# EAGLE design LT3652 (EAGLE 7.1.0)
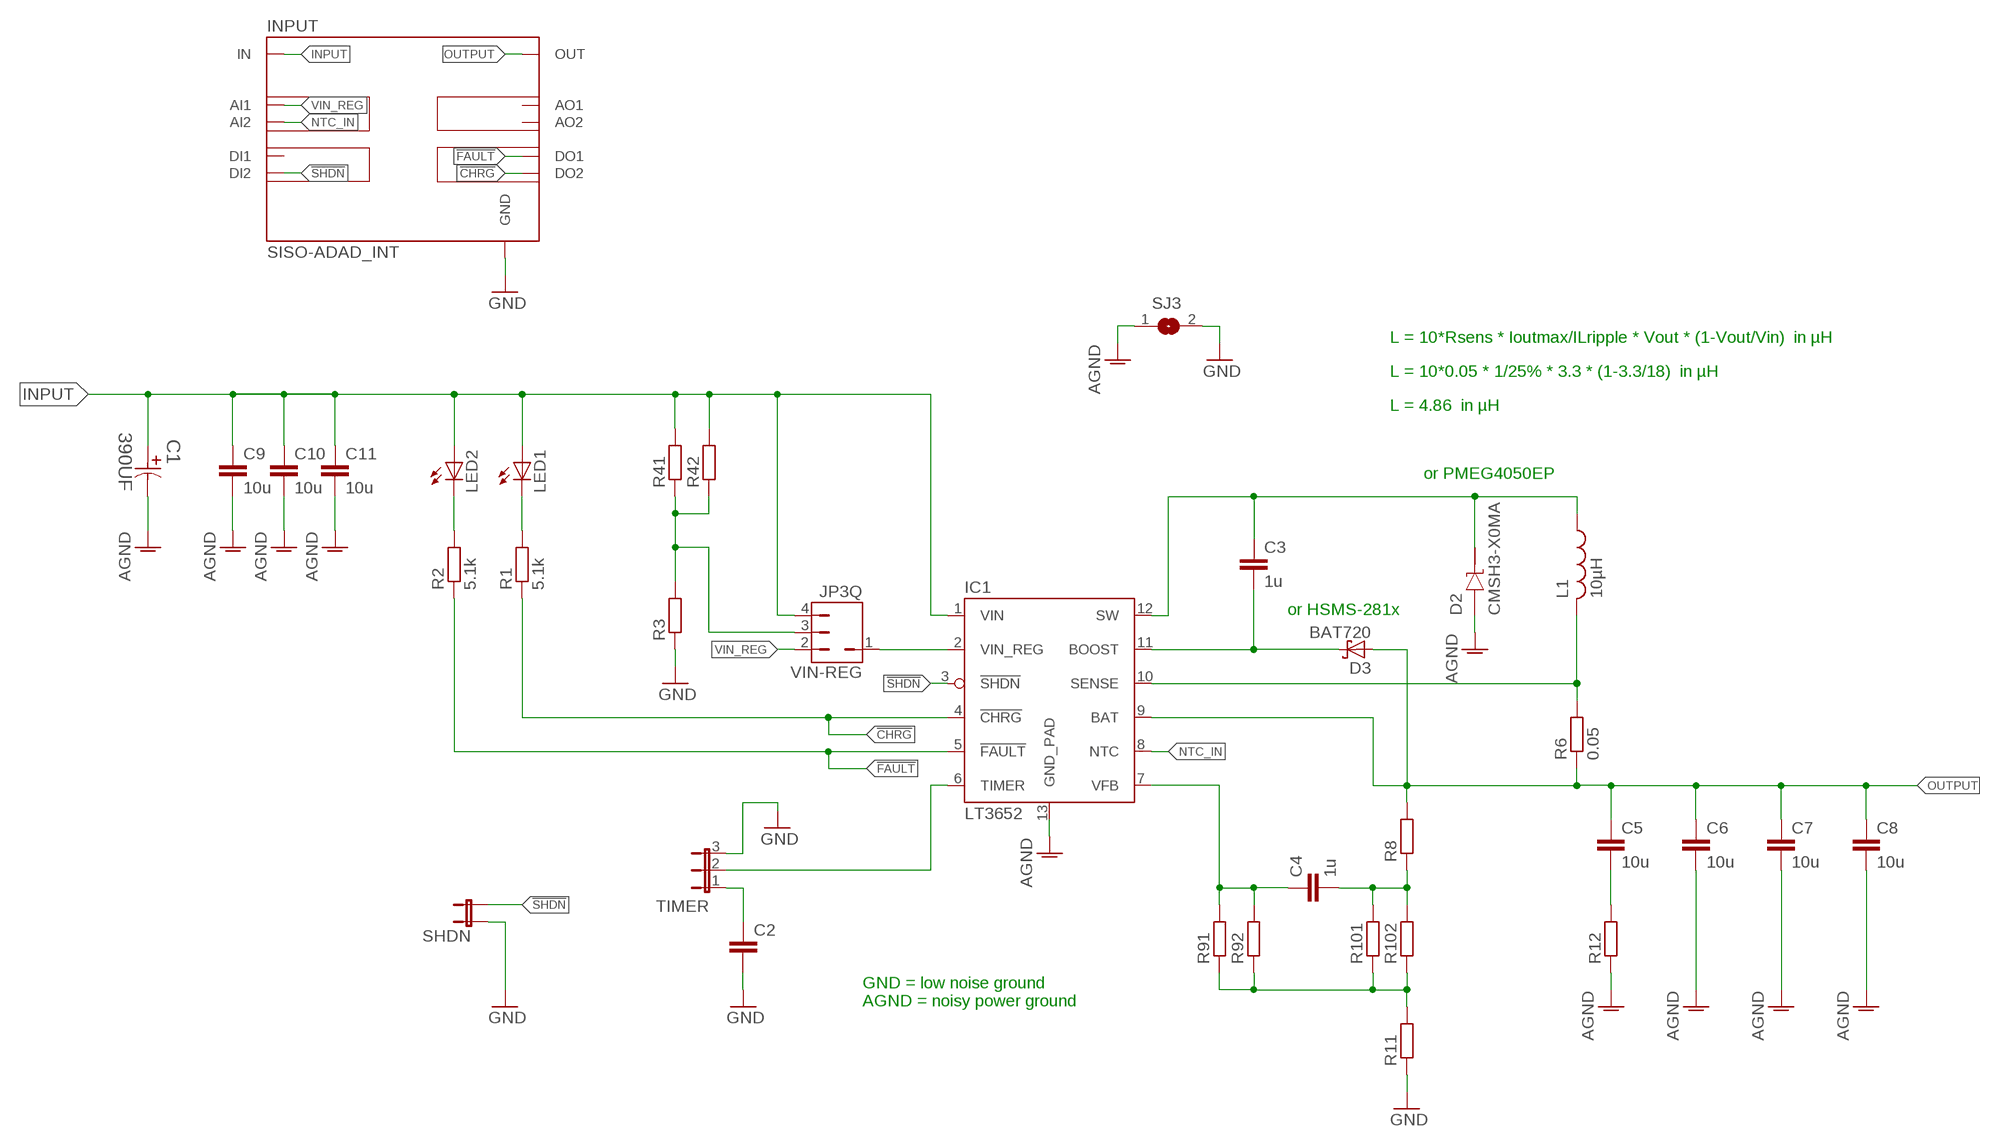
[diagram p0: schematic, sheet 1]

## Parts
C1  390UF  EEE-FPV391UAP-CASE-G  [CAPAE1030X1050N]
C2  C-EUC0805  [C0805]
C3  1u  C-EUC0805  [C0805]
C4  1u  C-EUC0805  [C0805]
C5  10u  C-EUC0805  [C0805]
C6  10u  C-EUC0805  [C0805]
C7  10u  C-EUC0805  [C0805]
C8  10u  C-EUC0805  [C0805]
C9  10u  C-EUC0805  [C0805]
C10  10u  C-EUC0805  [C0805]
C11  10u  C-EUC0805  [C0805]
D2  CMSH3-X0MA  [DIODE_SMA]
D3  BAT720  BAS70  [SOT23]
IC1  LT3652  [MSOP-12_GND]
INPUT  SISO-ADAD_INT  [SISO-ADAD]
L1  10µH  IHLP-2525CZ-01  [2525]
LED1  LEDCHIP-LED0805  [CHIP-LED0805]
LED2  LEDCHIP-LED0805  [CHIP-LED0805]
R1  5.1k  R-EU_R0805  [R0805]
R2  5.1k  R-EU_R0805  [R0805]
R3  R-EU_R0805  [R0805]
R6  0.05  R-EU_R1206  [R1206]
R8  R-EU_R0805  [R0805]
R11  R-EU_R0805  [R0805]
R12  R-EU_R0805  [R0805]
R41  R-EU_R0805  [R0805]
R42  R-EU_R0805  [R0805]
R91  R-EU_R0805  [R0805]
R92  R-EU_R0805  [R0805]
R101  R-EU_R0805  [R0805]
R102  R-EU_R0805  [R0805]
SHDN  JP2_SMALL_PAD  [JP2_SMALL_PAD]
SJ3  SJ2  [SJ2]
TIMER  JP3_SMALL_PAD  [JP3_SMALL_PAD]
VIN-REG  JP3Q  [JP1-3]

## Nets
!CHRG: IC1.4(!CHRG) INPUT.DO2 R1.1
!FAULT: IC1.5(!FAULT) INPUT.DO1 R2.1
!SHDN: IC1.3(!SHDN) INPUT.DI2 SHDN.2
AGND: C1.2 C6.2 C7.2 C8.2 C9.2 C10.2 C11.2 D2.A IC1.13(GND_PAD) R12.1 SJ3.1
D1: LED2.C R2.2
GND: C2.2 INPUT.GND1(GND) INPUT.GND2(GND) INPUT.GND3(GND) INPUT.GND4(GND) R3.1 R11.1 SHDN.1 SJ3.2 TIMER.3
INPUT: C1.1 C9.1 C10.1 C11.1 IC1.1(VIN) INPUT.IN1(IN) INPUT.IN2(IN) INPUT.IN3(IN) INPUT.IN4(IN) LED1.A LED2.A R41.2 R42.2 VIN-REG.4
N$1: IC1.6(TIMER) TIMER.2
N$4: LED1.C R1.2
N$6: R3.2 R41.1 R42.1 VIN-REG.3
N$7: IC1.2(VIN_REG) VIN-REG.1
N$9: C3.1 D2.C IC1.12(SW) L1.P$2
N$10: C3.2 D3.3(C) IC1.11(BOOST)
N$12: C2.1 TIMER.1
N$14: R11.2 R91.1 R92.1 R101.1 R102.1
N$15: C4.2 R8.1 R101.2 R102.2
N$16: C5.2 R12.2
N$17: IC1.10(SENSE) L1.P$1 R6.2
N$18: C4.1 IC1.7(VFB) R91.2 R92.2
NTC_IN: IC1.8(NTC) INPUT.AI2
OUTPUT: C5.1 C6.1 C7.1 C8.1 D3.1(A) IC1.9(BAT) INPUT.OUT1_1(OUT) INPUT.OUT1_2(OUT) INPUT.OUT1_3(OUT) INPUT.OUT1_4(OUT) R6.1 R8.2
VIN_REG: INPUT.AI1 VIN-REG.2
Unconnected: INPUT.AO1 INPUT.AO2 INPUT.DI1

## Notes on the sheet
- L = 10*Rsens * Ioutmax/ILripple * Vout * (1-Vout/Vin)  in µH
- L = 10*0.05 * 1/25% * 3.3 * (1-3.3/18)  in µH
- L = 4.86  in µH
- or PMEG4050EP
- or HSMS-281x
- GND = low noise ground
  AGND = noisy power ground

## Library data of the parts
C1 = Panasonic-EEEFK_EEEFP:EEE-: Aluminum Electrolytic Capacitors,Surface Mount Type; MPN: EEE-FPV391UAP; OC_FARNELL: 1539521; OC_NEWARK: 94M7004; PACKAGE: CASE-G; SUPPLIER: PANASONIC; TOLERANCE: ±20 %; VOLTAGERATING: 35V
C2-C11 = rcl:C-EU: CAPACITOR, European symbol
D2 = CMSH3-SMD-Diode:CMSH3-X0MA
D3 = diode:BAS70: Silicon Schottky Diodes General-purpose diode for high-speed switching
IC1 = LT3652:LT3652: LT3652 MPPT Solar Charge Controller 5V-32V smart charger for batteries up to 14.4V
INPUT = AllModules:SISO-ADAD_INT
L1 = Inductor-IHLP2525CZER100M11:IHLP-2525CZ-01
LED1 LED2 = led:LED: LED OSRAM: - CHIPLED LG R971, LG N971, LY N971, LG Q971, LY Q971, LO R971, LY R971 LH N974, LH R974 LS Q976, LO Q976, LY Q976 LO Q996 - Hyper CHIPLED LW Q18S LB Q993, LB Q99A, LB R99A - SideLED LS A670, LO A670, LY A670, LG A670, LP A670 LB A673, LV A673, LT A673, LW A673 LH A674 LY A675 LS A676, LA A676, LO A676, LY A676, LW A676 LS A679, LY A679, LG A679 - Hyper Micro SIDELED® LS Y876, LA Y876, LO Y876, LY Y876 LT Y87S - SmartLED LW L88C, LW L88S LB L89C, LB L89S, LG L890 LS L89K, LO L89K, LY L89K LS L896, LA L896, LO L896, LY L896 - TOPLED LS T670, LO T670, LY T670, LG T670, LP T670 LSG T670, LSP T670, LSY T670, LOP T670, LYG T670 LG T671, LOG T671, LSG T671 LB T673, LV T673, LT T673, LW T673 LH T674 LS T676, LA T676, LO T676, LY T676, LB T676, LH T676, LSB T676, LW T676 LB T67C, LV T67C, LT T67C, LS T67K, LO T67K, LY T67K, LW E67C LS E67B, LA E67B, LO E67B, LY E67B, LB E67C, LV E67C, LT E67C LW T67C LS T679, LY T679, LG T679 LS T770, LO T770, LY T770, LG T770, LP T770 LB T773, LV T773, LT T773, LW T773 LH T774 LS E675, LA E675, LY E675, LS T675 LS T776, LA T776, LO T776, LY T776, LB T776 LHGB T686 LT T68C, LB T68C - Hyper Mini TOPLED® LB M676 - Mini TOPLED Santana® LG M470 LS M47K, LO M47K, LY M47K Source: http://www.osram.convergy.de LUXEON: - LUMILED® LXK2-PW12-R00, LXK2-PW12-S00, LXK2-PW14-U00, LXK2-PW14-V00 LXK2-PM12-R00, LXK2-PM12-S00, LXK2-PM14-U00 LXK2-PE12-Q00, LXK2-PE12-R00, LXK2-PE12-S00, LXK2-PE14-T00, LXK2-PE14-U00 LXK2-PB12-K00, LXK2-PB12-L00, LXK2-PB12-M00, LXK2-PB14-N00, LXK2-PB14-P00, LXK2-PB14-Q00 LXK2-PR12-L00, LXK2-PR12-M00, LXK2-PR14-Q00, LXK2-PR14-R00 LXK2-PD12-Q00, LXK2-PD12-R00, LXK2-PD12-S00 LXK2-PH12-R00, LXK2-PH12-S00 LXK2-PL12-P00, LXK2-PL12-Q00, LXK2-PL12-R00 Source: www.luxeon.com KINGBRIGHT: KA-3528ASYC Source: www.kingbright.com
R1-R3 R6 R8 R11 R12 R41 R42 R91 R92 R101 R102 = rcl:R-EU_: RESISTOR, European symbol
SHDN = Jumper_mod:JP2_SMALL_PAD
SJ3 = Jumper_mod:SJ2: SMD solder JUMPER
TIMER = Jumper_mod:JP3_SMALL_PAD
VIN-REG = Jumper_mod:JP3Q

## Board
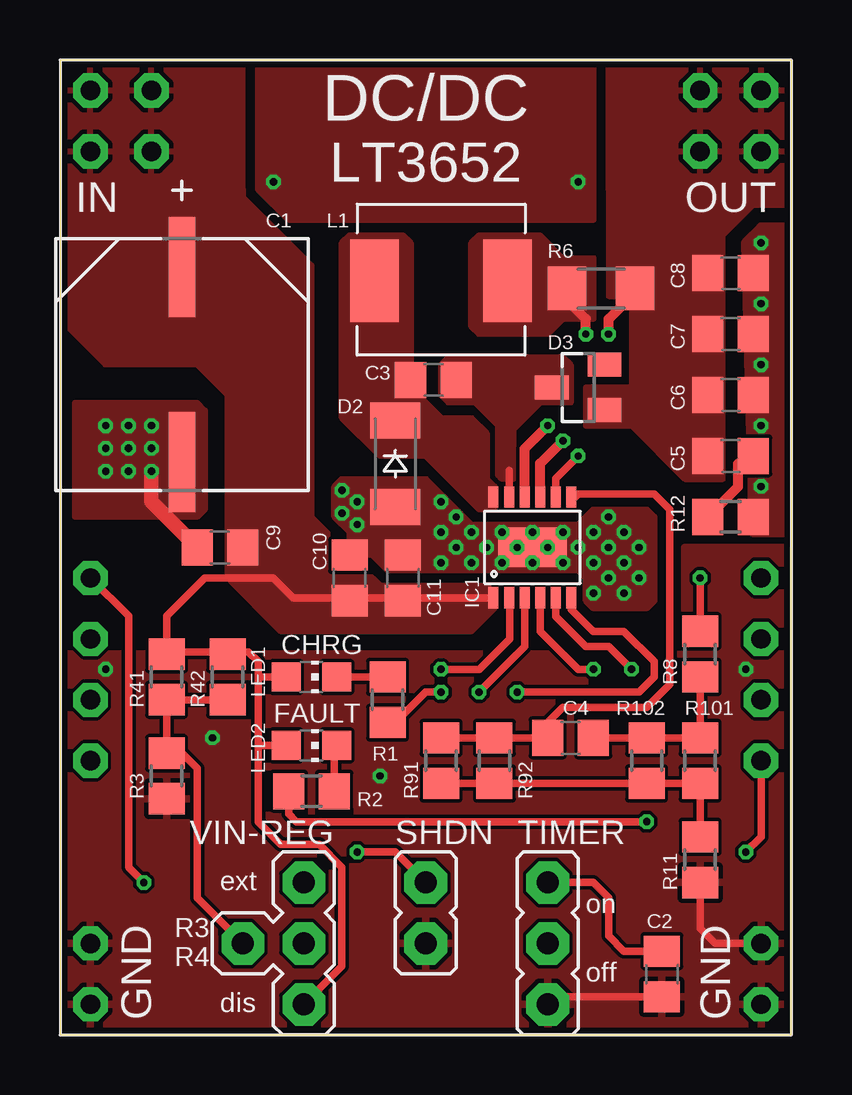
[diagram p1: board, top side]
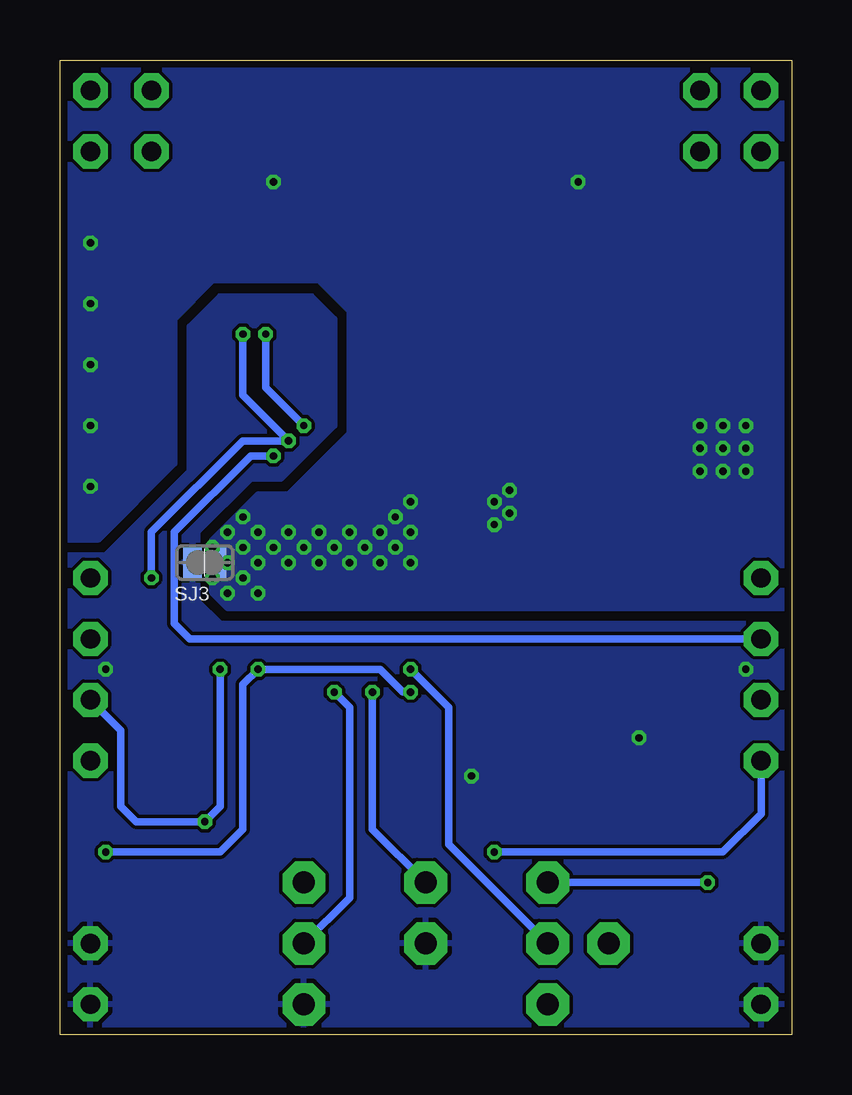
[diagram p2: board, bottom side, seen from below]

Size 30.48 x 40.64 mm. Coordinates in mm from the lower left corner, seen from the top.
Outline: 0,0 30.46,0 30.48,40.64 0,40.64 0,0
Copper layers (1*16): Top 0.035mm / dielectric 1.5mm / Bottom 0.035mm
Design rules "PCB-POOL Standard *": minimum track width 0.15mm, minimum drill 0.3mm, track to track 0.15mm, track to pad 0.15mm, pad to pad 0.15mm, via to via 0.15mm, smd to smd 0.15mm, copper to edge 0.3mm, drill to drill 0.2mm, minimum pad ring 0.2mm, minimum via ring 0.15mm, stop-mask expansion 0.075mm, vias tented up to drill 0mil, thermal gap 0.2mm

### Footprints (pad centres in the part's own frame; a part is rotated, then mirrored left to right if it is on the bottom)
CAPAE1030X1050N = smd 4.166 x 1.092: 1 -4.064,0; 2 4.064,0
C0805 = smd 1.3 x 1.5: 1 -0.95,0; 2 0.95,0
DIODE_SMA = smd 1.5 x 2.1: A 1.8,0; C -1.8,0
SOT23 = smd 1 x 1.4: 1 -0.95,-1.1; 2 0.95,-1.1; 3 0,1.1
MSOP-12_GND = smd 0.889 x 0.42: 1 -2.1,1.625; 2 -2.1,0.975; 3 -2.1,0.325; 4 -2.1,-0.325; 5 -2.1,-0.975; 6 -2.1,-1.625; 7 2.1,-1.625; 8 2.1,-0.975; 9 2.1,-0.325; 10 2.1,0.325; 11 2.1,0.975; 12 2.1,1.625 | smd 1.651 x 2.845: 13 0,0
SISO-ADAD = drill 0.8 pad 1.422 octagon: AI1 0,-20.32; AI2 0,-22.86; AO1 27.94,-20.32; AO2 27.94,-22.86; DI1 0,-25.4; DI2 0,-27.94; DO1 27.94,-25.4; DO2 27.94,-27.94; GND1 0,-38.1; GND2 0,-35.56; GND3 27.94,-35.56; GND4 27.94,-38.1; IN1 0,0; IN2 0,-2.54; IN3 2.54,0; IN4 2.54,-2.54; OUT1_1 25.4,0; OUT1_2 25.4,-2.54; OUT1_3 27.94,0; OUT1_4 27.94,-2.54
2525 = smd 2.032 x 3.429: P$1 2.769,0; P$2 -2.769,0
CHIP-LED0805 = smd 1.2 x 1.2: A 0,-1.05; C 0,1.05
R0805 = smd 1.3 x 1.5: 1 -0.95,0; 2 0.95,0
R1206 = smd 1.6 x 1.803: 1 -1.422,0; 2 1.422,0
JP2_SMALL_PAD = drill 0.914 pad 1.778 octagon: 1 -2.54,0; 2 0,0
SJ2 = smd 0.762 x 1.27: 1 -0.508,0; 2 0.508,0
JP3_SMALL_PAD = drill 0.914 pad 1.778 octagon: 1 -2.54,0; 2 0,0; 3 2.54,0
JP1-3 = drill 0.914 pad 1.778 octagon: 1 0,0; 2 0,2.54; 3 -2.54,0; 4 0,-2.54

### Placement (x,y rotation side)
C1  5.08,27.94 270 top
C2  25.08,2.54 270 top
C3  15.56,27.3 0 top
C4  21.27,12.38 0 top
C5  27.94,24.13 0 top
C6  27.94,26.67 0 top
C7  27.94,29.21 0 top
C8  27.94,31.75 0 top
C9  6.67,20.32 180 top
C10  12.06,19.05 90 top
C11  14.29,19.05 90 top
D2  13.97,23.81 270 top
D3  21.59,26.99 90 top
IC1  19.68,20.32 90 top
INPUT  1.27,39.37 0 top
L1  15.88,31.43 0 top
LED1  10.48,14.92 270 top
LED2  10.48,12.06 270 top
R1  13.65,13.97 90 top
R2  10.48,10.16 0 top
R3  4.45,10.79 90 top
R6  22.54,31.11 180 top
R8  26.67,15.88 90 top
R11  26.67,7.3 90 top
R12  27.94,21.59 180 top
R41  4.45,14.92 90 top
R42  6.99,14.92 90 top
R91  15.88,11.43 90 top
R92  18.1,11.43 90 top
R101  26.67,11.43 90 top
R102  24.45,11.43 90 top
SHDN  15.24,6.35 90 top
SJ3  24.45,19.68 180 bottom
TIMER  20.32,3.81 270 top
VIN-REG  10.16,3.81 0 top

### Tracks (layer width: path | path; a pad name or v marks a point on that pad's centre or on a via)
!CHRG  (via drill 0.3)
  Top 0.305: IC1.4 20.01,16.82 21.59,15.24 v22.23,15.24 | v28.57,7.62 29.21,8.26 INPUT.DO2 | v15.88,14.29 15.24,14.29 13.97,13.02 R1.1
  Bottom 0.305: v28.57,7.62 23.81,7.62 22.86,8.57 22.86,14.61 v22.23,15.24 17.14,15.24 16.19,14.29 v15.88,14.29
!FAULT  (via drill 0.3)
  Top 0.305: IC1.5 20.66,17.44 21.91,16.19 22.86,16.19 v23.81,15.24 | v24.45,8.89 9.84,8.89 9.53,9.21 R2.1
  Top 0.406: IC1.5 20.64,18.2
  Bottom 0.305: v23.81,15.24 23.81,9.53 v24.45,8.89 27.3,8.89 27.94,9.53 27.94,12.7 INPUT.DO1
!SHDN  (via drill 0.3)
  Top 0.305: IC1.3 19.36,16.18 v17.46,14.29 | v12.38,7.62 13.97,7.62 SHDN.2
  Top 0.406: IC1.3
  Bottom 0.305: v17.46,14.29 17.46,8.57 SHDN.2 | v12.38,7.62 2.86,7.62 1.27,9.21 INPUT.DI2
AGND  (via drill 0.3)
  Top 0.61: C9.2 3.81,22.23 v3.81,23.5
  other vias: 12.38,22.23 12.38,21.27 15.88,20.95 15.88,22.23 2.86,23.5 1.91,23.5 1.91,25.4 2.86,25.4 2.86,24.45 1.91,24.45 18.41,19.68 19.68,20.95 20.95,19.68 18.41,20.95 20.95,20.95 19.68,19.68 29.21,22.86 29.21,25.4 29.21,27.94 29.21,30.48 29.21,33.02 3.81,25.4 3.81,24.45 19.05,20.32 20.32,20.32 17.78,20.32 17.14,20.95 16.51,20.32 16.51,21.59 21.59,20.32 22.23,20.95 22.23,19.68 22.86,20.32 23.5,20.95 23.5,19.68 22.86,21.59 22.86,19.05 23.5,18.41 22.23,18.41 17.14,19.68 15.88,19.68 24.13,20.32 24.13,19.05 11.75,21.75 11.75,22.7 8.89,35.56 21.59,35.56
  pour Bottom (no thermals): -0.64,17.78 23.5,17.78 24.13,18.41 24.13,20.64 22.23,22.54 20.95,22.54 18.41,25.08 18.41,30.16 19.68,31.43 24.13,31.43 25.72,29.84 25.72,23.81 28.89,20.64 31.11,20.64 31.11,41.27 -0.64,41.27
  pour Top (no thermals): 11.43,22.86 11.75,23.18 15.24,23.18 17.14,21.27 21.59,21.27 22.23,21.91 24.45,21.91 24.77,21.59 24.77,18.1 24.45,17.78 22.23,17.78 21.91,18.1 21.91,19.05 21.59,19.37 13.65,19.37 13.02,20 12.06,20 12.06,20.95 11.43,21.59
  pour Top (no thermals): 0.64,26.35 5.71,26.35 6.03,26.04 6.03,21.91 5.71,21.59 0.64,21.59
  pour Top (no thermals): 30.48,33.66 29.21,33.66 28.57,33.02 28.89,20.95 30.48,20.95
  pour Top (no thermals): 8.26,41.27 22.23,41.27 22.23,33.97 9.53,33.97 8.26,35.24
D1
  Top 0.305: R2.2 11.43,11.96 LED2.C
GND  (via drill 0.3)
  Top 0.305: C2.2 20.64,1.59 | R11.1 26.67,4.45 27.3,3.81 INPUT.GND3
  Top 0.406: 20.64,1.59 TIMER.3
  other vias: 13.34,10.79 28.57,15.24 6.35,12.38 1.91,15.24
  pour Bottom: -0.64,17.14 -0.64,-0.64 31.11,-0.64 31.11,20 28.57,20 25.08,23.5 25.08,29.53 23.81,30.8 20,30.8 19.05,29.84 19.05,25.4 21.27,23.18 22.54,23.18 24.77,20.95 24.77,18.1 23.81,17.14
  pour Top: -1.27,-1.27 31.75,-1.27 31.75,20.32 26.04,20.32 26.04,17.14 24.77,15.88 -1.27,15.88
INPUT
  Top 0.305: VIN-REG.4 11.75,2.86 11.75,6.99 10.79,7.94 9.21,7.94 8.26,8.89 8.26,12.06 | IC1.1 9.72,18.22 8.89,19.05 6.03,19.05 4.45,17.46 4.45,15.97 | 6.99,15.97 4.45,15.97 | 4.45,15.97 R41.2 | R42.2 6.99,15.97 | 6.99,15.97 7.84,15.97 8.26,15.56 8.26,14.92 | 8.26,14.92 8.26,12.06 | LED2.A 8.26,12.06 | LED1.A 8.26,14.92
  pour Top (no thermals): 0,35.24 7.62,35.24 7.62,34.92 10.48,32.07 10.48,21.59 11.43,20.64 11.43,19.37 12.7,19.37 13.34,18.73 17.78,18.73 18.1,18.41 18.1,17.78 17.14,16.83 9.21,16.83 6.99,19.05 6.99,26.67 5.71,27.94 1.91,27.94 0,29.84
  pour Top: 7.62,34.92 7.62,40.64 0,40.64 0,34.92
N$1  (via drill 0.3)
  Top 0.305: v19.05,14.29 24.13,14.29 24.77,14.92 24.77,15.56 23.5,16.83 22.23,16.83 21.31,17.74 IC1.6
  Bottom 0.305: v19.05,14.29 18.41,13.65 18.41,5.71 TIMER.2
N$4
  Top 0.305: LED1.C R1.2
N$5
  Bottom 0.406: 24.13,19.68 24.77,19.68
N$6
  Top 0.305: R42.1 R41.1 R3.2 5.08,11.74 5.71,11.11 5.71,5.71 VIN-REG.3
N$7  (via drill 0.3 pad 0.3)
  Top 0.305: 18.73,18.2 18.73,16.51 17.46,15.24 v15.88,15.24
  Top 0.406: IC1.2 18.73,18.2
  Bottom 0.305: VIN-REG.1 14.29,7.94 14.29,13.65 v15.88,15.24
N$9
  Top 0.406: 13.26,30.96 L1.P$2
  pour Top (no thermals): 17.78,25.08 17.78,23.18 18.1,22.86 18.1,21.91 17.46,21.91 15.24,24.13 13.34,24.13 11.75,25.72 11.75,33.02 12.06,33.34 14.29,33.34 14.61,33.02 14.61,26.99 15.88,25.72 17.14,25.72
N$10
  Top 0.305: IC1.11 18.71,23.52
  pour Top (no thermals): 21.27,26.35 20,26.35 18.89,25.24 18.89,23.18 18.41,23.18 18.26,23.34 18.26,25.4 17.3,26.35 16.19,26.35 15.88,26.67 15.88,27.94 16.19,28.26 20.95,28.26 21.27,27.94
N$12
  Top 0.305: TIMER.1 22.23,6.35 22.86,5.71 22.86,4.13 23.5,3.49 C2.1
N$14
  Top 0.305: R11.2 R101.1 R102.1 R92.1 R91.1
N$15
  Top 0.305: R8.1 R101.2 R102.2 23.18,12.38 C4.2
N$16
  Top 0.406: R12.2 28.26,22.86 28.26,23.81 28.57,23.81 C5.2
N$17  (via drill 0.3)
  Top 0.406: IC1.10 19.36,24.44 v20.32,25.4 | 21.18,31.11 R6.2 21.12,30.63 21.91,29.84 v21.91,29.21
  Bottom 0.305: v20.32,25.4 21.91,26.99 v21.91,29.21
  pour Top (no thermals): 17.14,33.02 17.46,33.34 20,33.34 20.95,32.38 22.23,32.38 22.23,29.84 20.95,29.84 20.32,29.21 17.46,29.21 17.14,29.53
N$18
  Top 0.305: R91.2 R92.2 19.68,12.38 19.69,12.38 C4.1 20.32,13.02 20.95,13.65 24.45,13.65 25.4,14.61 25.4,21.91 24.77,22.54 21.59,22.54 21.47,22.42 IC1.7 21.39,22.42
NTC_IN  (via drill 0.3)
  Top 0.305: IC1.8 20.66,23.2 v21.59,24.13
  Bottom 0.305: v21.59,24.13 22.54,24.13 25.72,20.95 25.72,17.14 25.08,16.51 INPUT.AI2
OUTPUT  (via drill 0.3)
  Top 0.305: v26.67,19.05 R8.2
  Top 0.406: IC1.9 20.01,23.82 v20.95,24.77 | 23.81,31.11 R6.1 | 23.96,30.63 R6.1 | v22.86,29.21 22.86,29.84 23.96,30.95 R6.1
  Bottom 0.305: v22.86,29.21 22.86,26.67 v20.95,24.77 22.86,24.77 26.67,20.95 v26.67,19.05
  pour Top (no thermals): 30.48,35.56 22.86,35.56 22.86,30.8 23.81,30.8 23.81,26.99 21.91,26.99 21.91,25.4 23.81,25.4 26.04,23.18 27.62,23.18 27.62,33.34 28.89,34.61 30.48,34.61
  pour Top: 30.48,35.24 22.86,35.24 22.86,40.64 30.48,40.64
VIN_REG  (via drill 0.3)
  Top 0.305: v3.49,6.35 2.86,6.99 2.86,17.46 INPUT.AI1
  Bottom 0.305: VIN-REG.2 v3.49,6.35

### Text on the board
tNames: DC/DC | LT3652 | CHRG | FAULT | ext | on | R3 / R4 | off | dis
bStop: by Kokert & Younesi / 25.04.2017